# Altium schematic sheet Data Connector.SchDoc
size A; SheetNumber: 3; SheetTotal: 6
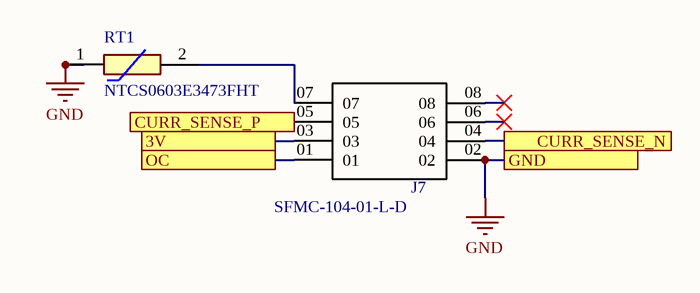
[diagram p0: Data Connector.SchDoc]

## Parts
J7  SFMC-104-01-L-D  [*SAMTEC_SFMC-104-01-L-D_SFMC-104-01-L-D(Primary)]
RT1  NTCS0603E3473FHT  [THRMC1608X95N]

## Ports
3V, CURR_SENSE_N, CURR_SENSE_P, GND, OC

## Nets
GND: J7.02 RT1.1 ; port GND
3V: J7.03 ; port 3V
CURR_SENSE_N: J7.04 ; port CURR_SENSE_N
CURR_SENSE_P: J7.05 ; port CURR_SENSE_P
OC: J7.01 ; port OC
NetJ7_07: J7.07 RT1.2

Not connected (* = marked no-connect by the designer): J7 06* 08*

## Library data of the parts
RT1 = NTCS0603E3473FHT: Thermistor; Manufacturer_Name: Vishay; Datasheet Link: https://datasheet.datasheetarchive.com/originals/distributors/Datasheets-DGA6/547972.pdf; Height: 0.95mm; Manufacturer_Part_Number: NTCS0603E3473FHT; Mouser Part Number: 594-NTCS0603E3473FHT; Mouser Price/Stock: https://www.mouser.co.uk/ProductDetail/Vishay-BC-Components/NTCS0603E3473FHT?qs=%2FWiulJ9oly5JyPnR8jCnHg%3D%3D; Arrow Part Number: NTCS0603E3473FHT; Arrow Price/Stock: https://www.arrow.com/en/products/ntcs0603e3473fht/vishay
J7 = SFMC-104-01-L-D: Value: *